# Altium schematic sheet LCD_TFT.SchDoc: LCD_TFT
size A3; DocumentNumber: MB1144; Revision: C-02; SheetNumber: 11; SheetTotal: 25; PageSetup: Record=PageOptions|CenterHorizontal=True|CenterVertical=True|PrintScale=1.01|XCorrection=1.00|YCorrection=1.00|PrintKind=1|BorderSize=5000000|LeftOffset=0|BottomOffset=0|Orientation=2|PaperLength=1000|PaperWidth=1000|Scale=100|PaperSource=15|PrintQuality=600|MediaType=1|DitherType=10|PaperKind=A3|PrintScaleMode=1; Project: STM32L476G-EVAL; ModifiedDate: 9/23/2015
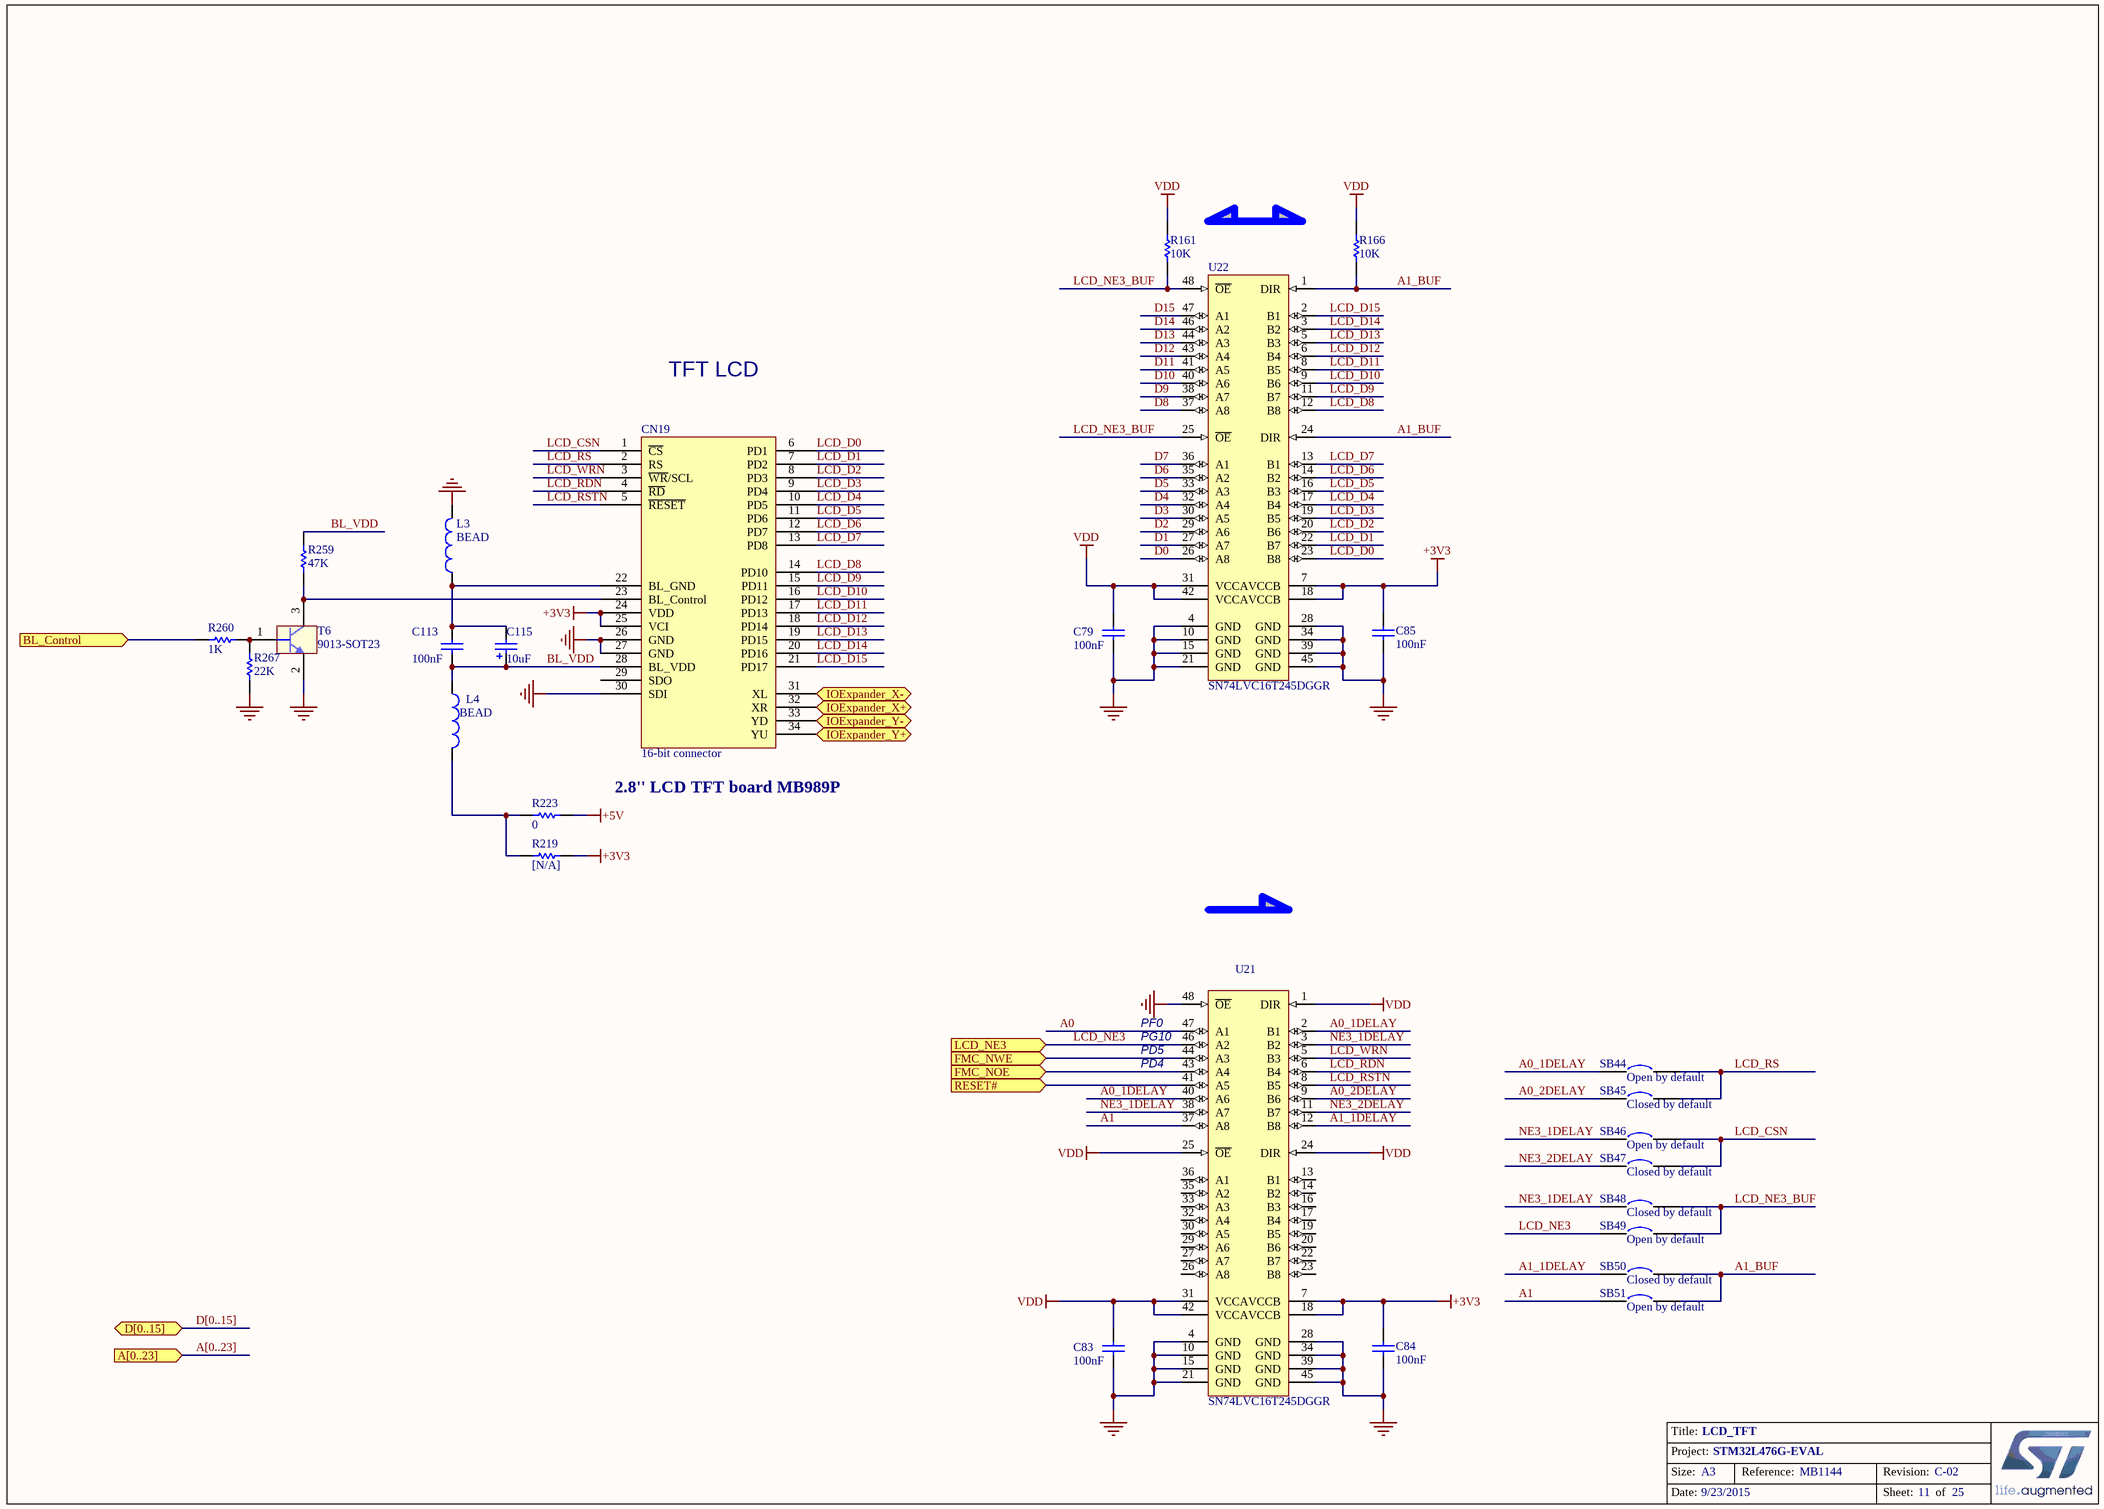
[diagram p0: LCD_TFT.SchDoc]

## Parts
C79  100nF  [0402C]
C83  100nF  [0402C]
C84  100nF  [0402C]
C85  100nF  [0402C]
C113  100nF  [0402C]
C115  10uF  [TAN-A]
CN19  16-bit connector  [HDR_2X17_2R54]
L3  BEAD  [0603L]
L4  BEAD  [0603L]
R161  10K  [0402R]
R166  10K  [0402R]
R219  [N/A]  [0603R]
R223  0  [0603R]
R259  47K  [0402R]
R260  1K  [0402R]
R267  22K  [0402R]
SB44  Open by default  [SB_0603]
SB45  Closed by default  [SB_0603]
SB46  Open by default  [SB_0603]
SB47  Closed by default  [SB_0603]
SB48  Closed by default  [SB_0603]
SB49  Open by default  [SB_0603]
SB50  Closed by default  [SB_0603]
SB51  Open by default  [SB_0603]
T6  9013-SOT23  [SOT-23]
U21  SN74LVC16T245DGGR  [TSSOP48_0R5_12R5X8R1]
U22  SN74LVC16T245DGGR  [TSSOP48_0R5_12R5X8R1]

## Ports
A[0..23] (in), BL_Control (in), D[0..15] (bidir), FMC_NOE (in), FMC_NWE (in), IOExpander_X+ (bidir), IOExpander_X- (bidir), IOExpander_Y+ (bidir), IOExpander_Y- (bidir), LCD_NE3 (in), RESET# (in)

## Nets
+3V3: C84.1 C85.1 CN19.24(VDD) CN19.25(VCI) R219.1 U21.7(VCCB) U21.18(VCCB) U22.7(VCCB) U22.18(VCCB)
+5V: R223.1
GND: C79.2 C83.2 C84.2 C85.2 CN19.26(GND) CN19.27(GND) CN19.30(SDI) L3.2 R267.2 T6.2(E) U21.4(GND) U21.10(GND) U21.15(GND) U21.21(GND) U21.28(GND) U21.34(GND) U21.39(GND) U21.45(GND) U21.48(~{OE}) U22.4(GND) U22.10(GND) U22.15(GND) U22.21(GND) U22.28(GND) U22.34(GND) U22.39(GND) U22.45(GND)
VDD: C79.1 C83.1 R161.1 R166.1 U21.1(DIR) U21.24(DIR) U21.25(~{OE}) U21.31(VCCA) U21.42(VCCA) U22.31(VCCA) U22.42(VCCA)
A0: U21.47(A1)
A0_1DELAY: SB44.1 U21.2(B1) U21.40(A6)
A0_2DELAY: SB45.1 U21.9(B6)
A1: SB51.1 U21.37(A8)
A1_1DELAY: SB50.1 U21.12(B8)
A1_BUF: R166.2 SB50.2 SB51.2 U22.1(DIR) U22.24(DIR)
BL_Control: R260.1 ; port BL_Control
BL_VDD: C113.2 C115.1 CN19.28(BL_VDD) L4.1 R259.1
D0: U22.26(A8)
D1: U22.27(A7)
D2: U22.29(A6)
D3: U22.30(A5)
D4: U22.32(A4)
D5: U22.33(A3)
D6: U22.35(A2)
D7: U22.36(A1)
D8: U22.37(A8)
D9: U22.38(A7)
D10: U22.40(A6)
D11: U22.41(A5)
D12: U22.43(A4)
D13: U22.44(A3)
D14: U22.46(A2)
D15: U22.47(A1)
FMC_NOE: U21.43(A4) ; port FMC_NOE
FMC_NWE: U21.44(A3) ; port FMC_NWE
IOExpander_X+: CN19.32(XR) ; port IOExpander_X+
IOExpander_X-: CN19.31(XL) ; port IOExpander_X-
IOExpander_Y+: CN19.34(YU) ; port IOExpander_Y+
IOExpander_Y-: CN19.33(YD) ; port IOExpander_Y-
LCD_CSN: CN19.1(~{CS}) SB46.2 SB47.2
LCD_D0: CN19.6(PD1) U22.23(B8)
LCD_D1: CN19.7(PD2) U22.22(B7)
LCD_D2: CN19.8(PD3) U22.20(B6)
LCD_D3: CN19.9(PD4) U22.19(B5)
LCD_D4: CN19.10(PD5) U22.17(B4)
LCD_D5: CN19.11(PD6) U22.16(B3)
LCD_D6: CN19.12(PD7) U22.14(B2)
LCD_D7: CN19.13(PD8) U22.13(B1)
LCD_D8: CN19.14(PD10) U22.12(B8)
LCD_D9: CN19.15(PD11) U22.11(B7)
LCD_D10: CN19.16(PD12) U22.9(B6)
LCD_D11: CN19.17(PD13) U22.8(B5)
LCD_D12: CN19.18(PD14) U22.6(B4)
LCD_D13: CN19.19(PD15) U22.5(B3)
LCD_D14: CN19.20(PD16) U22.3(B2)
LCD_D15: CN19.21(PD17) U22.2(B1)
LCD_NE3: SB49.1 U21.46(A2) ; port LCD_NE3
LCD_NE3_BUF: R161.2 SB48.2 SB49.2 U22.25(~{OE}) U22.48(~{OE})
LCD_RDN: CN19.4(~{RD}) U21.6(B4)
LCD_RS: CN19.2(RS) SB44.2 SB45.2
LCD_RSTN: CN19.5(~{RESET}) U21.8(B5)
LCD_WRN: CN19.3(~{WR}/SCL) U21.5(B3)
NE3_1DELAY: SB46.1 SB48.1 U21.3(B2) U21.38(A7)
NE3_2DELAY: SB47.1 U21.11(B7)
RESET#: U21.41(A5) ; port RESET#
NetC113_1: C113.1 C115.2 CN19.22(BL_GND) L3.1
NetCN19_23: CN19.23(BL_Control) R259.2 T6.3(C)
NetL4_2: L4.2 R219.2 R223.2
NetR260_2: R260.2 R267.1 T6.1(B)

Not connected (* = marked no-connect by the designer): CN19 29(SDO); U21 13(B1) 14(B2) 16(B3) 17(B4) 19(B5) 20(B6) 22(B7) 23(B8) 26(A8) 27(A7) 29(A6) 30(A5) 32(A4) 33(A3) 35(A2) 36(A1)

## Buses and harness runs
bus A[0..23] = port A[0..23]
bus D[0..15] = port D[0..15]

## Notes on the sheet
- TFT LCD
- 2.8'' LCD TFT board MB989P
- (near U21) PG10
- (near U21) PD5
- (near U21) PF0
- (near U21) PD4
- Title:
- Project:
- Size:
- Date:
- A3
- Reference:
- Sheet:
- Revision:
- of

## Library data of the parts
C79 C83-C85 = CAP: Capacitor; Value: 100pF; Ordered by: Subcon; ECCN_US/EU: NA; Published: 8-Jun-2000; Revision: July-2002: Re-released for DXP Platform.; Publisher: Altium Limited
C113 = Cap: Capacitor; Value: 10nF; Ordered by: Subcon; ECCN_US/EU: NA; Published: 8-Jun-2000; Revision: July-2002: Re-released for DXP Platform.; Publisher: Altium Limited
C115 = Cap Pol1: Polarized Capacitor (Radial); Ordered by: Subcon; ECCN_US/EU: NA; Published: 8-Jun-2000; Revision: July-2002: Re-released for DXP Platform.; Publisher: Altium Limited; Value: 10uF
CN19 = ColorLCD_module_16bits: Female connector 2x17; Ordered by: Subcon; Comments: LCD TFT paralell; Assembly: with MB989P revB; ECCN_US/EU: NA
L3 L4 = Inductor: Value: 100uH; Ordered by: Subcon; ECCN_US/EU: NA; Published: 8-Jun-2000; Revision: July-2002: Re-released for DXP Platform.; Publisher: Altium Limited
R161 R166 R267 = res1: Resistor; Value: 1K; Ordered by: Subcon; ECCN_US/EU: NA; Published: 8-Jun-2000; Revision: July-2002: Re-released for DXP Platform.; Publisher: Altium Limited
R219 = Res1: Resistor; Value: 1K; Ordered by: Subcon; ECCN_US/EU: NA; Fitted: NO; Published: 8-Jun-2000; Revision: July-2002: Re-released for DXP Platform.; Publisher: Altium Limited
R223 R259 = Res1: Resistor; Value: 1K; Ordered by: Subcon; ECCN_US/EU: NA; Published: 8-Jun-2000; Revision: July-2002: Re-released for DXP Platform.; Publisher: Altium Limited
R260 = Res1: Resistor; Ordered by: Subcon; ECCN_US/EU: NA; Published: 8-Jun-2000; Revision: July-2002: Re-released for DXP Platform.; Publisher: Altium Limited; Value: 1K
SB44 SB46 SB49 SB51 = Circuit Breaker: Ordered by: Subcon; Comments: Solder bridge; Fitted: NO; ECCN_US/EU: NA; Published: 24-Mar-1999; Revision: July-2002: Re-released for DXP Platform.; Publisher: Altium Limited
SB45 SB47 SB48 SB50 = Circuit Breaker: Ordered by: Subcon; Comments: Solder bridge; ECCN_US/EU: NA; Published: 24-Mar-1999; Revision: July-2002: Re-released for DXP Platform.; Publisher: Altium Limited
T6 = 9013-SOT23: NPN Bipolar Transistor; Manuf_1: Taitron; Manuf_Part_1: MMBT9013; Description: NPN Bipolar Transistor, SOT-23 Footprint; Ordered by: Subcon; ECCN_US/EU: EAR99/NEC; Revision: July-2002: Re-released for DXP Platform.; Order: MMBT9013
U21 U22 = SN74LVC16T245: Manuf_1: TI; Ordered by: Subcon; ECCN_US/EU: EAR99/NEC; Manuf_Part_1: SN74LVC16T245DGGR